# Altium project bms_mainboard-1_1.PrjPcb (part 7 of 8)

## Sheet eth_10base-t1s_phy.SchDoc
size B
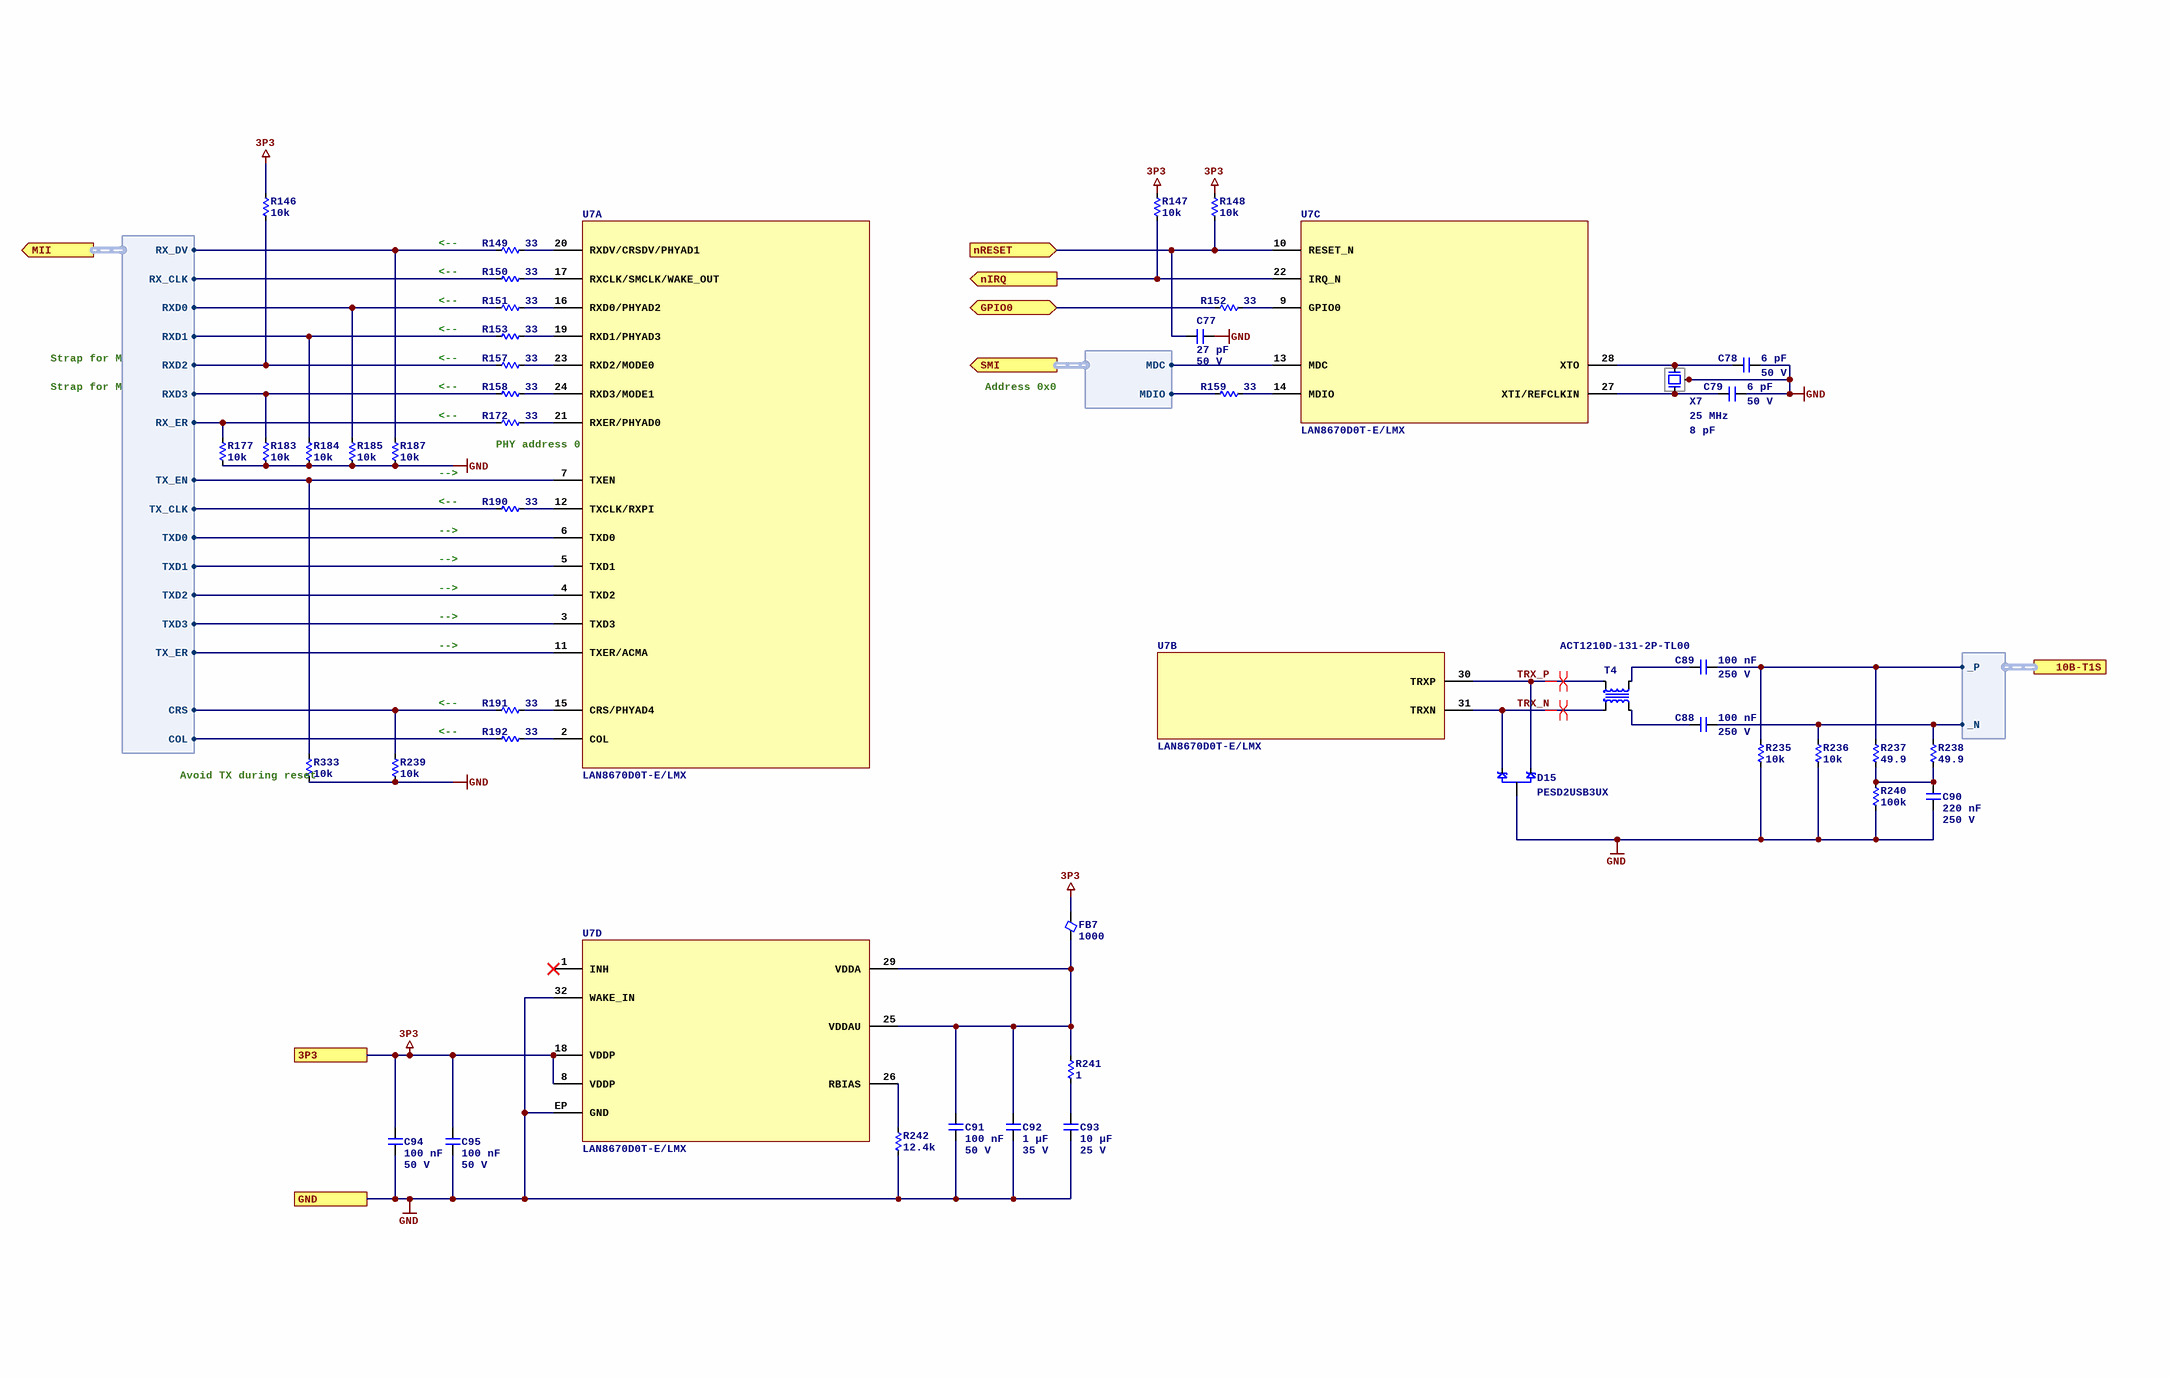
[diagram p39: eth_10base-t1s_phy.SchDoc]

### Parts
C77  Capacitance: 27 pF  Voltage Rating: 50 V  [C0402]  (hidden comment: 0402CG270J500NT)
C78  Capacitance: 6 pF  Voltage Rating: 50 V  [C0402]  (hidden comment: 0402CG6R0C500NT)
C79  Capacitance: 6 pF  Voltage Rating: 50 V  [C0402]  (hidden comment: 0402CG6R0C500NT)
C88  Capacitance: 100 nF  Voltage Rating: 250 V  [C1206]  (hidden comment: FM31X104K251EEG)
C89  Capacitance: 100 nF  Voltage Rating: 250 V  [C1206]  (hidden comment: FM31X104K251EEG)
C90  Capacitance: 220 nF  Voltage Rating: 250 V  [C1210]  (hidden comment: FM32X224K251EEG)
C91  Capacitance: 100 nF  Voltage Rating: 50 V  [C0402]  (hidden comment: CL05B104KB54PNC)
C92  Capacitance: 1 µF  Voltage Rating: 35 V  [C0603]  (hidden comment: GMK107AB7105KAHT)
C93  Capacitance: 10 µF  Voltage Rating: 25 V  [C0805]  (hidden comment: CL21B106KAYQNNE)
C94  Capacitance: 100 nF  Voltage Rating: 50 V  [C0402]  (hidden comment: CL05B104KB54PNC)
C95  Capacitance: 100 nF  Voltage Rating: 50 V  [C0402]  (hidden comment: CL05B104KB54PNC)
D15  PESD2USB3UX  [3SOT23]
FB7  Current Rating (mA): 1000  [FB0805]  (hidden comment: HCB2012KF-102T10)
R146  value 10k  [R0402]  (hidden comment: 0402WGF1002TCE)
R147  value 10k  [R0402]  (hidden comment: 0402WGF1002TCE)
R148  value 10k  [R0402]  (hidden comment: 0402WGF1002TCE)
R149  value 33  [R0402]  (hidden comment: 0402WGF330JTCE)
R150  value 33  [R0402]  (hidden comment: 0402WGF330JTCE)
R151  value 33  [R0402]  (hidden comment: 0402WGF330JTCE)
R152  value 33  [R0402]  (hidden comment: 0402WGF330JTCE)
R153  value 33  [R0402]  (hidden comment: 0402WGF330JTCE)
R157  value 33  [R0402]  (hidden comment: 0402WGF330JTCE)
R158  value 33  [R0402]  (hidden comment: 0402WGF330JTCE)
R159  value 33  [R0402]  (hidden comment: 0402WGF330JTCE)
R172  value 33  [R0402]  (hidden comment: 0402WGF330JTCE)
R177  value 10k  [R0402]  (hidden comment: 0402WGF1002TCE)
R183  value 10k  [R0402]  (hidden comment: 0402WGF1002TCE)
R184  value 10k  [R0402]  (hidden comment: 0402WGF1002TCE)
R185  value 10k  [R0402]  (hidden comment: 0402WGF1002TCE)
R187  value 10k  [R0402]  (hidden comment: 0402WGF1002TCE)
R190  value 33  [R0402]  (hidden comment: 0402WGF330JTCE)
R191  value 33  [R0402]  (hidden comment: 0402WGF330JTCE)
R192  value 33  [R0402]  (hidden comment: 0402WGF330JTCE)
R235  value 10k  [R1206]  (hidden comment: 1206W4F1002T5E)
R236  value 10k  [R1206]  (hidden comment: 1206W4F1002T5E)
R237  value 49.9  [R1206]  (hidden comment: FRC1206F49R9TS)
R238  value 49.9  [R1206]  (hidden comment: FRC1206F49R9TS)
R239  value 10k  [R0402]  (hidden comment: 0402WGF1002TCE)
R240  value 100k  [R1206]  (hidden comment: 1206W4F1003T5E)
R241  value 1  [R0402]  (hidden comment: CRCW04021R00FKED)
R242  value 12.4k  [R0402]  (hidden comment: 0402WGD1242TCE)
R333  value 10k  [R0402]  (hidden comment: 0402WGF1002TCE)
T4  ACT1210D-131-2P-TL00  [CHOKE_ACT1210D-131-2P-TL00]
U7  LAN8670D0T-E/LMX  [QFN50P500X500X90-32N]  (parts A,B,C,D of 4)
X7  Frequency: 25 MHz  Capacitance: 8 pF  [4_SMD_2.0X1.6MM]  (hidden comment: ABM11W-25.0000MHZ-8-D1X-T3)

### Ports
3P3, 10B-T1S (harness DIFF), GND, GPIO0 (bidir), MII (out, harness MII), nIRQ (out), nRESET (in), SMI (out, harness SMI)

### Harnesses
MII: RXD0, RXD1, TX_EN, TXD0, TXD1, RXD2, RXD3, TXD2, TXD3, TX_ER, TX_CLK, CRS, COL, RX_ER, RX_DV, RX_CLK
SMI: MDC, MDIO
DIFF: _N, _P

### Nets
3P3: C94.1 C95.1 FB7.2 R146.1 R147.1 R148.1 U7.8(VDDP) U7.18(VDDP) ; port 3P3
GND: C77.2 C78.2 C79.2 C90.2 C91.2 C92.2 C93.2 C94.2 C95.2 D15.3 R177.2 R183.2 R184.2 R185.2 R187.2 R235.2 R236.2 R239.2 R240.2 R242.2 R333.2 U7.32(WAKE_IN) U7.EP(GND) X7.2 X7.4 ; port GND
10B-T1S_MDI._N: C88.2 R236.1 R238.1 ; port 10B-T1S._N
10B-T1S_MDI._P: C89.2 R235.1 R237.1 ; port 10B-T1S._P
MII_P7.COL: R192.2 ; port MII.COL
MII_P7.CRS: R191.2 R239.1 ; port MII.CRS
MII_P7.RX_CLK: R150.2 ; port MII.RX_CLK
MII_P7.RX_DV: R149.2 R187.1 ; port MII.RX_DV
MII_P7.RX_ER: R172.2 R177.1 ; port MII.RX_ER
MII_P7.RXD0: R151.2 R185.1 ; port MII.RXD0
MII_P7.RXD1: R153.2 R184.1 ; port MII.RXD1
MII_P7.RXD2: R146.2 R157.2 ; port MII.RXD2
MII_P7.RXD3: R158.2 R183.1 ; port MII.RXD3
MII_P7.TX_CLK: R190.2 ; port MII.TX_CLK
MII_P7.TX_EN: R333.1 U7.7(TXEN) ; port MII.TX_EN
MII_P7.TX_ER: U7.11(TXER/ACMA) ; port MII.TX_ER
MII_P7.TXD0: U7.6(TXD0) ; port MII.TXD0
MII_P7.TXD1: U7.5(TXD1) ; port MII.TXD1
MII_P7.TXD2: U7.4(TXD2) ; port MII.TXD2
MII_P7.TXD3: U7.3(TXD3) ; port MII.TXD3
PHY_GPIO0: R152.2 ; port GPIO0
PHY_nIRQ: R147.2 U7.22(IRQ_N) ; port nIRQ
PHY_nRESET: C77.1 R148.2 U7.10(RESET_N) ; port nRESET
SMI.MDC: U7.13(MDC) ; port SMI.MDC
SMI.MDIO: R159.2 ; port SMI.MDIO
TRX_N: D15.1 T4.1 U7.31(TRXN)
TRX_P: D15.2 T4.2 U7.30(TRXP)
NetC78_1: C78.1 U7.28(XTO) X7.3
NetC79_1: C79.1 U7.27(XTI/REFCLKIN) X7.1
NetC88_1: C88.1 T4.4
NetC89_1: C89.1 T4.3
NetC90_1: C90.1 R237.2 R238.2 R240.1
NetC91_1: C91.1 C92.1 FB7.1 R241.2 U7.25(VDDAU) U7.29(VDDA)
NetC93_1: C93.1 R241.1
NetR149_1: R149.1 U7.20(RXDV/CRSDV/PHYAD1)
NetR150_1: R150.1 U7.17(RXCLK/SMCLK/WAKE_OUT)
NetR151_1: R151.1 U7.16(RXD0/PHYAD2)
NetR152_1: R152.1 U7.9(GPIO0)
NetR153_1: R153.1 U7.19(RXD1/PHYAD3)
NetR157_1: R157.1 U7.23(RXD2/MODE0)
NetR158_1: R158.1 U7.24(RXD3/MODE1)
NetR159_1: R159.1 U7.14(MDIO)
NetR172_1: R172.1 U7.21(RXER/PHYAD0)
NetR190_1: R190.1 U7.12(TXCLK/RXPI)
NetR191_1: R191.1 U7.15(CRS/PHYAD4)
NetR192_1: R192.1 U7.2(COL)
NetR242_1: R242.1 U7.26(RBIAS)

Not connected (* = marked no-connect by the designer): U7 1(INH)*

### Layout directives
differential pair; differential pair class DE_100: TRX_N, TRX_P

### Notes on the sheet
- <--
- Strap for MII
- Address 0x0
- (near R187) <--
- PHY address 0
- -->
- (near R187) -->
- (near R239) <--
- (near R333) Avoid TX during reset

### Library data of the parts
C77 = 0402CG270J500NT: Manufacturer: FH(Guangdong Fenghua Advanced Tech); Dielectric: C0G; ComponentLink1URL: https://wmsc.lcsc.com/wmsc/upload/file/pdf/v2/lcsc/2304140030_FH--Guangdong-Fenghua-Advanced-Tech-0402CG270J500NT_C1557.pdf; ComponentLink1Description: Datasheet; Manufacturer Part Number: 0402CG270J500NT; Package: 0402; Supplier 2: LCSC; Supplier Part Number 2: C1557
C78 C79 = 0402CG6R0C500NT: Manufacturer: FH(Guangdong Fenghua Advanced Tech); Dielectric: C0G; ComponentLink1URL: https://wmsc.lcsc.com/wmsc/upload/file/pdf/v2/lcsc/2304140030_FH--Guangdong-Fenghua-Advanced-Tech-0402CG6R0C500NT_C1575.pdf; ComponentLink1Description: Datasheet; Manufacturer Part Number: 0402CG6R0C500NT; Package: 0402; Supplier 2: LCSC; Supplier Part Number 2: C1575
C88 C89 = FM31X104K251EEG: Manufacturer: PSA(Prosperity Dielectrics); Dielectric: X7R; ComponentLink1URL: https://wmsc.lcsc.com/wmsc/upload/file/pdf/v2/lcsc/2409271633_PSA-Prosperity-Dielectrics-FM31X104K251EEG_C365814.pdf; ComponentLink1Description: Datasheet; Manufacturer Part Number: FM31X104K251EEG; Package: 1206; Supplier 2: LCSC; Supplier Part Number 2: C365814
C90 = FM32X224K251EEG: Manufacturer: PSA(Prosperity Dielectrics); Dielectric: X7R; ComponentLink1URL: https://wmsc.lcsc.com/wmsc/upload/file/pdf/v2/lcsc/2304140030_PSA-Prosperity-Dielectrics-FM32X224K251EEG_C146177.pdf; ComponentLink1Description: Datasheet; Manufacturer Part Number: FM32X224K251EEG; Package: 1210; Supplier 2: LCSC; Supplier Part Number 2: C146177
C91 C94 C95 = CL05B104KB54PNC: Manufacturer: Samsung Electro-Mechanics; Dielectric: X7R; ComponentLink1URL: https://wmsc.lcsc.com/wmsc/upload/file/pdf/v2/lcsc/2304140030_Samsung-Electro-Mechanics-CL05B104KB54PNC_C307331.pdf; ComponentLink1Description: Datasheet; Manufacturer Part Number: CL05B104KB54PNC; Package: 0402; Supplier 2: LCSC; Supplier Part Number 2: C307331
C92 = GMK107AB7105KAHT: Manufacturer: Taiyo Yuden; Dielectric: X7R; ComponentLink1URL: https://datasheet.lcsc.com/lcsc/2304140030_Taiyo-Yuden-GMK107AB7105KAHT_C841050.pdf; ComponentLink1Description: Datasheet; Manufacturer Part Number: GMK107AB7105KAHT; Package: 0603; Supplier 2: LCSC; Supplier Part Number 2: C841050
C93 = CL21B106KAYQNNE: Manufacturer: Samsung Electro-Mechanics; Dielectric: X7R; ComponentLink1URL: https://datasheet.lcsc.com/lcsc/2206222030_Samsung-Electro-Mechanics-CL21B106KAYQNNE_C3039694.pdf; ComponentLink1Description: Datasheet; Manufacturer Part Number: CL21B106KAYQNNE; Package: 0805; Supplier 2: LCSC; Supplier Part Number 2: C3039694
D15 = PESD2USB3UX: DIODE ESD USB SOT-23; Manufacturer: Nexperia USA Inc.; Polarity: Unidirectional; Capacitance (pF): 0.7; Standoff (V): 3.3; Min Breakdown Voltage: 4.2 V; Supplier 1: DigiKey; Supplier Part Number 1: 1727-PESD2USB3UX-CT-ND; Manufacturer Part Number: PESD2USB3UX; Supplier 2: LCSC; Supplier Part Number 2: C3708426; ComponentLink1Description: Datasheet; ComponentLink1URL: https://assets.nexperia.com/documents/data-sheet/PESD2USB3UX-T.pdf; Supplier 3: Mouser; Supplier Part Number 3: 771-PESD2USB3UX-TR
FB7 = HCB2012KF-102T10: Manufacturer: TAI-TECH; DCR (mOhms): 200; ComponentLink1URL: https://wmsc.lcsc.com/wmsc/upload/file/pdf/v2/lcsc/2009171138_TAI-TECH-HCB2012KF-102T10_C356985.pdf; ComponentLink1Description: Datasheet; Manufacturer Part Number: HCB2012KF-102T10; Supplier 2: LCSC; Supplier Part Number 2: C356985; Package: 0805; Z @ 100 MHz: 1000
R146-R148 R177 R183-R185 R187 R239 R333 = 0402WGF1002TCE: Manufacturer: UNI-ROYAL(Uniroyal Elec); Tolerance: 1%; Temperature Coefficient: ±100ppm/?; Power Rating (mW): 62.5; ComponentLink1Description: Datasheet; ComponentLink1URL: https://wmsc.lcsc.com/wmsc/upload/file/pdf/v2/lcsc/2206010100_UNI-ROYAL-Uniroyal-Elec-0402WGF1002TCE_C25744.pdf; Manufacturer Part Number: 0402WGF1002TCE; Package: 0402; Supplier 2: LCSC; Supplier Part Number 2: C25744
R149-R153 R157-R159 R172 R190-R192 = 0402WGF330JTCE: Manufacturer: UNI-ROYAL(Uniroyal Elec); Tolerance: 1%; Temperature Coefficient: ±100ppm/?; Power Rating (mW): 62.5; ComponentLink1Description: Datasheet; ComponentLink1URL: https://wmsc.lcsc.com/wmsc/upload/file/pdf/v2/lcsc/2205311900_UNI-ROYAL-Uniroyal-Elec-0402WGF330JTCE_C25105.pdf; Manufacturer Part Number: 0402WGF330JTCE; Package: 0402; Supplier 2: LCSC; Supplier Part Number 2: C25105
R235 R236 = 1206W4F1002T5E: Manufacturer: UNI-ROYAL(Uniroyal Elec); Tolerance: 1%; Temperature Coefficient: ±100ppm/?; Power Rating (mW): 250; ComponentLink1Description: Datasheet; ComponentLink1URL: https://wmsc.lcsc.com/wmsc/upload/file/pdf/v2/lcsc/2206010145_UNI-ROYAL-Uniroyal-Elec-1206W4F1002T5E_C17902.pdf; Manufacturer Part Number: 1206W4F1002T5E; Package: 1206; Supplier 2: LCSC; Supplier Part Number 2: C17902
R237 R238 = FRC1206F49R9TS: Manufacturer: FOJAN; Tolerance: 1%; Temperature Coefficient: ±100ppm/?; Power Rating (mW): 250; ComponentLink1Description: Datasheet; ComponentLink1URL: https://datasheet.lcsc.com/lcsc/2308241947_FOJAN-FRC1206F49R9TS_C2907389.pdf; Manufacturer Part Number: FRC1206F49R9TS; Package: 1206; Supplier 2: LCSC; Supplier Part Number 2: C2907389
R240 = 1206W4F1003T5E: Manufacturer: UNI-ROYAL(Uniroyal Elec); Tolerance: 1%; Temperature Coefficient: ±100ppm/?; Power Rating (mW): 250; ComponentLink1Description: Datasheet; ComponentLink1URL: https://wmsc.lcsc.com/wmsc/upload/file/pdf/v2/lcsc/2206010145_UNI-ROYAL-Uniroyal-Elec-1206W4F1003T5E_C17900.pdf; Manufacturer Part Number: 1206W4F1003T5E; Package: 1206; Supplier 2: LCSC; Supplier Part Number 2: C17900
R241 = CRCW04021R00FKED: Manufacturer: Vishay Intertech; Tolerance: 1%; Temperature Coefficient: ±100ppm/?; Power Rating (mW): 63; ComponentLink1Description: Datasheet; ComponentLink1URL: https://wmsc.lcsc.com/wmsc/upload/file/pdf/v2/lcsc/2211030200_Vishay-Intertech-CRCW04021R00FKED_C482087.pdf; Manufacturer Part Number: CRCW04021R00FKED; Package: 0402; Supplier 2: LCSC; Supplier Part Number 2: C482087
R242 = 0402WGD1242TCE: Manufacturer: UNI-ROYAL(Uniroyal Elec); Tolerance: 0.5%; Temperature Coefficient: ±100ppm/?; Power Rating (mW): 62.5; ComponentLink1Description: Datasheet; ComponentLink1URL: https://wmsc.lcsc.com/wmsc/upload/file/pdf/v2/lcsc/2411221127_UNI-ROYAL-Uniroyal-Elec-0402WGD1242TCE_C407750.pdf; Manufacturer Part Number: 0402WGD1242TCE; Package: 0402; Supplier 2: LCSC; Supplier Part Number 2: C407750
T4 = ACT1210D-131-2P-TL00: 130 µH @ 100 kHz 2 Line Common Mode Choke Surface Mount 6.7 kOhms @ 10 MHz 115mA DCR 3.5Ohm; Manufacturer: TDK Corporation; Supplier 1: DigiKey; ComponentLink1URL: https://product.tdk.com/system/files/dam/doc/product/emc/emc/cmf_cmc/catalog/cmf_automotive_signal_act1210d_en.pdf; ComponentLink1Description: Datasheet; Supplier Part Number 1: 445-ACT1210D-131-2P-TL00CT-ND; Manufacturer Part Number: ACT1210D-131-2P-TL00; Supplier 2: LCSC; Supplier Part Number 2: C5547342; Supplier 3: Mouser; Supplier Part Number 3: 810-ACT1210D1312PTL0
U7 = LAN8670D0T-E/LMX: 10BASE-T1S PHY WITH MII/RMII "1/1 Transceiver Full, Half Ethernet 32-VQFN (5x5)"; Manufacturer: Microchip; Supplier 1: DigiKey; Supplier Part Number 1: 150-LAN8670D0T-E/LMXTR-ND; Manufacturer Part Number: LAN8670D0T-E/LMX; ComponentLink1Description: Datasheet; ComponentLink1URL: https://ww1.microchip.com/downloads/aemDocuments/documents/AIS/ProductDocuments/DataSheets/LAN8670-1-2-Data-Sheet-60001573.pdf; Supplier 3: Microchip Direct; Supplier Part Number 3: LAN8670D0T-E/LMX
X7 = ABM11W-25.0000MHZ-8-D1X-T3: 25 MHz ±10ppm Crystal 8pF 50 Ohms 4-SMD, No Lead; Manufacturer: Abracon LLC; Supplier 1: DigiKey; Supplier Part Number 1: 535-13853-1-ND; Manufacturer Part Number: ABM11W-25.0000MHZ-8-D1X-T3; Supplier 2: LCSC; Supplier Part Number 2: C1985767; ComponentLink1Description: Datasheet; ComponentLink1URL: https://abracon.com/Resonators/ABM11W.pdf; Supplier 3: Mouser; Supplier Part Number 3: 815-11W25-8D1XT

## Sheet isolator_si8662.SchDoc
size A
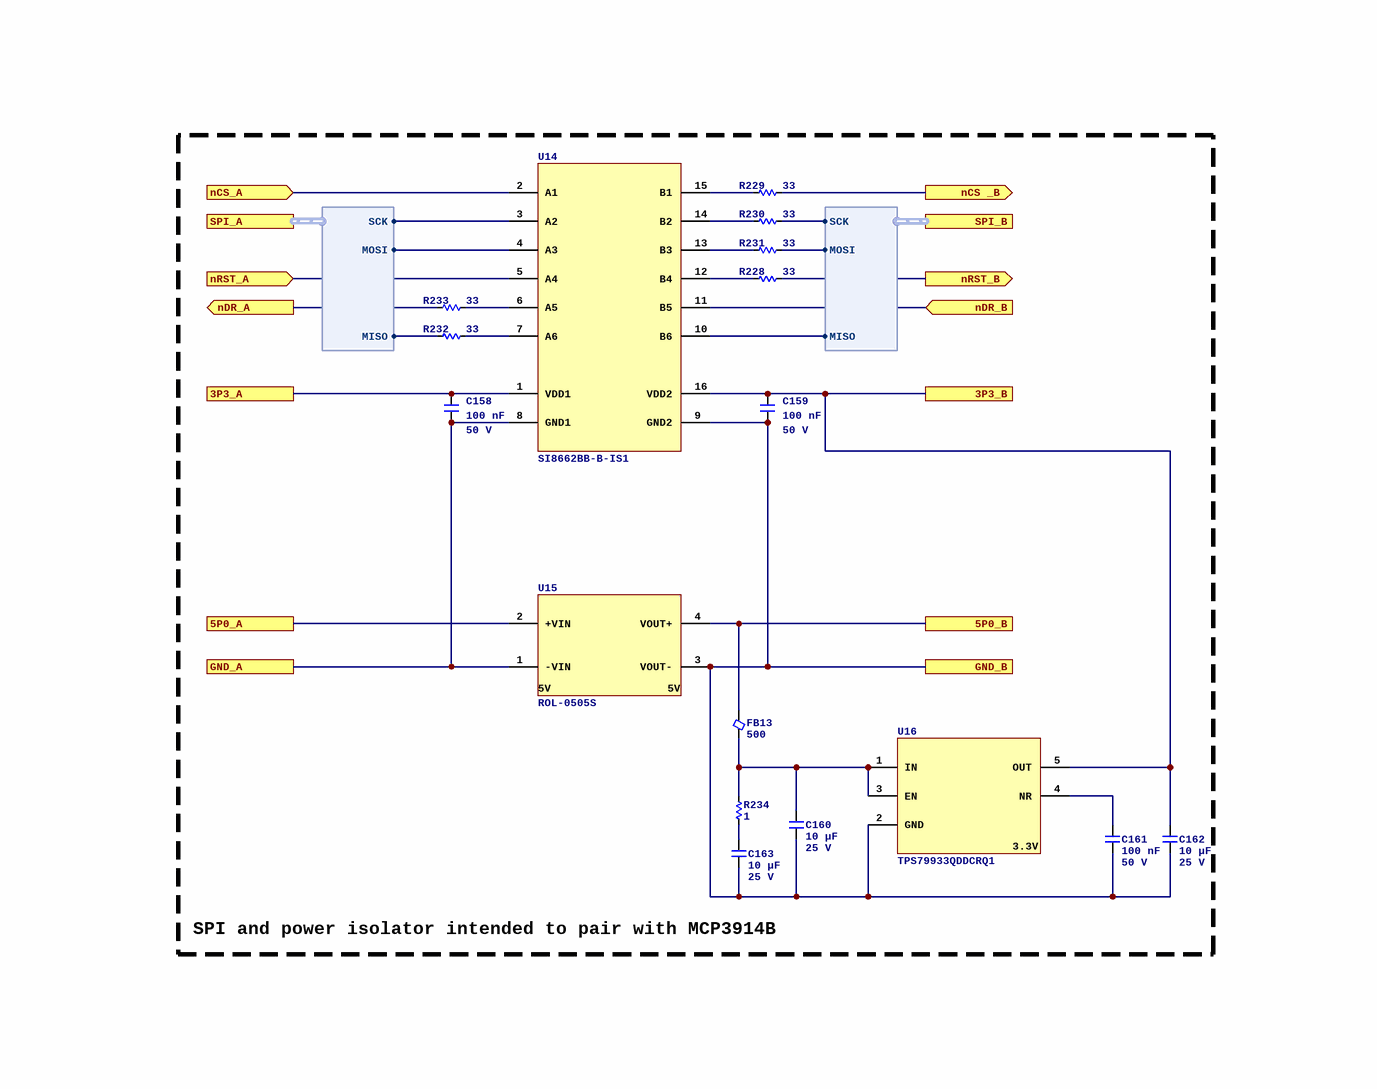
[diagram p40: isolator_si8662.SchDoc]

### Parts
C158  Capacitance: 100 nF  Voltage Rating: 50 V  [C0402]  (hidden comment: CL05B104KB54PNC)
C159  Capacitance: 100 nF  Voltage Rating: 50 V  [C0402]  (hidden comment: CL05B104KB54PNC)
C160  Capacitance: 10 µF  Voltage Rating: 25 V  [C0603]  (hidden comment: CL10A106MA8NRNC)
C161  Capacitance: 100 nF  Voltage Rating: 50 V  [C0402]  (hidden comment: CL05B104KB54PNC)
C162  Capacitance: 10 µF  Voltage Rating: 25 V  [C0805]  (hidden comment: CL21B106KAYQNNE)
C163  Capacitance: 10 µF  Voltage Rating: 25 V  [C0805]  (hidden comment: CL21B106KAYQNNE)
FB13  Current Rating (mA): 500  [FB0402]  (hidden comment: BLM15AX601SN1D)
R228  value 33  [R0402]  (hidden comment: 0402WGF330JTCE)
R229  value 33  [R0402]  (hidden comment: 0402WGF330JTCE)
R230  value 33  [R0402]  (hidden comment: 0402WGF330JTCE)
R231  value 33  [R0402]  (hidden comment: 0402WGF330JTCE)
R232  value 33  [R0402]  (hidden comment: 0402WGF330JTCE)
R233  value 33  [R0402]  (hidden comment: 0402WGF330JTCE)
R234  value 1  [R0402]  (hidden comment: CRCW04021R00FKED)
U14  SI8662BB-B-IS1  [16SOIC150]
U15  ROL-0505S  [4SIP]
U16  TPS79933QDDCRQ1  [5SOT23]

### Blocks framed on the sheet
SPI and power isolator intended to pair with MCP3914B: C158-C163 FB13 R228-R234 U14-U16

### Ports
3P3_A, 3P3_B, 5P0_A, 5P0_B, GND_A, GND_B, nCS _B (out), nCS_A (in), nDR_A (out), nDR_B (in), nRST_A (in), nRST_B (out), SPI_A (harness SPI), SPI_B (harness SPI)

### Harnesses
SPI: MISO, MOSI, SCK

### Nets
3P3: C158.1 U14.1(VDD1) ; port 3P3_A
3P3_B: C159.1 C162.1 U14.16(VDD2) U16.5(OUT) ; port 3P3_B
5P0: U15.2(+VIN) ; port 5P0_A
5P0_B: FB13.2 U15.4(VOUT+) ; port 5P0_B
GND: C158.2 U14.8(GND1) U15.1(-VIN) ; port GND_A
HV_N: C159.2 C160.2 C161.2 C162.2 C163.2 U14.9(GND2) U15.3(VOUT-) U16.2(GND) ; port GND_B
MCP3914B_nDR: R233.2 ; port nDR_A
MCP3914B_nDR_ISO: U14.11(B5) ; port nDR_B
MCP3914B_nRST: U14.5(A4) ; port nRST_A
MCP3914B_nRST_ISO: R228.1 ; port nRST_B
SPI4.MISO: R232.2 ; port SPI_A.MISO
SPI4.MOSI: U14.4(A3) ; port SPI_A.MOSI
SPI4.SCK: U14.3(A2) ; port SPI_A.SCK
SPI4_ISO.MISO: U14.10(B6) ; port SPI_B.MISO
SPI4_ISO.MOSI: R231.1 ; port SPI_B.MOSI
SPI4_ISO.SCK: R230.1 ; port SPI_B.SCK
SPI4_nSS: U14.2(A1) ; port nCS_A
SPI4_nSS_ISO: R229.1 ; port nCS _B
NetC160_1: C160.1 FB13.1 R234.2 U16.1(IN) U16.3(EN)
NetC161_1: C161.1 U16.4(NR)
NetC163_1: C163.1 R234.1
NetR228_2: R228.2 U14.12(B4)
NetR229_2: R229.2 U14.15(B1)
NetR230_2: R230.2 U14.14(B2)
NetR231_2: R231.2 U14.13(B3)
NetR232_1: R232.1 U14.7(A6)
NetR233_1: R233.1 U14.6(A5)

### Notes on the sheet
- (in symbol ROL-0505S) 5V
- (in symbol TPS79933QDDCRQ1) 3.3V

### Library data of the parts
C158 C159 C161 = CL05B104KB54PNC: as C91 on sheet eth_10base-t1s_phy; ComponentLink1URL: https://wmsc.lcsc.com/wmsc/upload/file/pdf/v2/lcsc/2304140030_Samsung-Electro-Mechanics-CL05B104KB54PNC_C307331.pdf; ComponentLink1Description: Datasheet; Manufacturer Part Number: CL05B104KB54PNC; Package: 0402; Supplier 2: LCSC; Supplier Part Number 2: C307331
C160 = CL10A106MA8NRNC: Manufacturer: Samsung Electro-Mechanics; Dielectric: X5R; ComponentLink1URL: https://wmsc.lcsc.com/wmsc/upload/file/pdf/v2/lcsc/2304140030_Samsung-Electro-Mechanics-CL10A106MA8NRNC_C96446.pdf; ComponentLink1Description: Datasheet; Manufacturer Part Number: CL10A106MA8NRNC; Package: 0603; Supplier 2: LCSC; Supplier Part Number 2: C96446
C162 C163 = CL21B106KAYQNNE: as C93 on sheet eth_10base-t1s_phy; ComponentLink1URL: https://datasheet.lcsc.com/lcsc/2206222030_Samsung-Electro-Mechanics-CL21B106KAYQNNE_C3039694.pdf; ComponentLink1Description: Datasheet; Manufacturer Part Number: CL21B106KAYQNNE; Package: 0805; Supplier 2: LCSC; Supplier Part Number 2: C3039694
FB13 = BLM15AX601SN1D: Manufacturer: Murata Electronics; Z @ 100 MHz: 600; DCR (mOhms): 340; ComponentLink1URL: https://wmsc.lcsc.com/wmsc/upload/file/pdf/v2/lcsc/2304140030_Murata-Electronics-BLM15AX601SN1D_C76886.pdf; ComponentLink1Description: Datasheet; Manufacturer Part Number: BLM15AX601SN1D; Supplier 2: LCSC; Supplier Part Number 2: C76886; Package: 0402
R228-R233 = 0402WGF330JTCE: as R149-R153 on sheet eth_10base-t1s_phy; ComponentLink1Description: Datasheet; ComponentLink1URL: https://wmsc.lcsc.com/wmsc/upload/file/pdf/v2/lcsc/2205311900_UNI-ROYAL-Uniroyal-Elec-0402WGF330JTCE_C25105.pdf; Manufacturer Part Number: 0402WGF330JTCE; Package: 0402; Supplier 2: LCSC; Supplier Part Number 2: C25105
R234 = CRCW04021R00FKED: as R241 on sheet eth_10base-t1s_phy; ComponentLink1Description: Datasheet; ComponentLink1URL: https://wmsc.lcsc.com/wmsc/upload/file/pdf/v2/lcsc/2211030200_Vishay-Intertech-CRCW04021R00FKED_C482087.pdf; Manufacturer Part Number: CRCW04021R00FKED; Package: 0402; Supplier 2: LCSC; Supplier Part Number 2: C482087
U14 = SI8662BB-B-IS1: 6-ch 2.5kV Isolator, 150M, 4/2, NB SOIC16, lead free; Manufacturer: Skyworks Solutions; Supplier 1: DigiKey; Supplier Part Number 1: SI8662BB-B-IS1-ND; Manufacturer Part Number: SI8662BB-B-IS1; Supplier 2: LCSC; Supplier Part Number 2: C430287; ComponentLink1Description: Datasheet; ComponentLink1URL: https://www.skyworksinc.com/-/media/Skyworks/SL/documents/public/data-sheets/Si866x.pdf; Supplier 3: Mouser; Supplier Part Number 3: 634-SI8662BB-B-IS1
U15 = ROL-0505S: 5V to 5V isolated power supply module; Manufacturer: Recom; Supplier 1: DigiKey; Supplier Part Number 1: 945-1949-5-ND; Manufacturer Part Number: ROL-0505S; ComponentLink1Description: Datasheet; ComponentLink1URL: https://recom-power.com/pdf/Econoline/ROL.pdf; Supplier 2: LCSC; Supplier Part Number 2: C22372006
U16 = TPS79933QDDCRQ1: Fixed Positive LDO Regulator, 3.3V, 0.16V Dropout, BICMOS, PDSO5; Manufacturer: Texas Instruments; Supplier 1: DigiKey; Supplier Part Number 1: 296-24852-1-ND; Manufacturer Part Number: TPS79933QDDCRQ1; ComponentLink1Description: Datasheet; ComponentLink1URL: https://www.ti.com/lit/ds/symlink/tps799-q1.pdf; Supplier 2: LCSC; Supplier Part Number 2: C2865613; Supplier 3: Mouser; Supplier Part Number 3: 595-TPS79933QDDCRQ1

## Sheet pmic_tps79933.SchDoc
size A
Used 2 times, as channels pmic_tps79933_usb, pmic_tps79933_gnss. Parts and nets are listed once, with the designators drawn on the sheet.
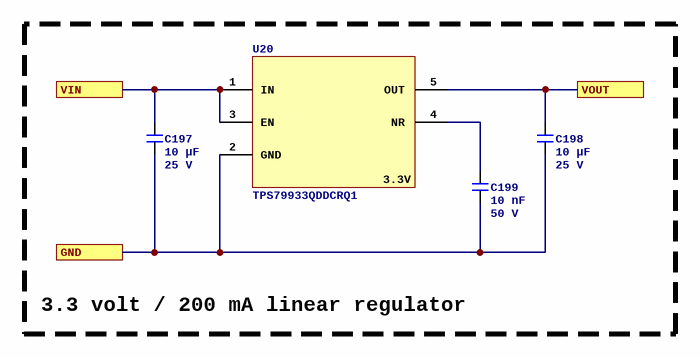
[diagram p41: pmic_tps79933.SchDoc]

### Parts
C197  Capacitance: 10 µF  Voltage Rating: 25 V  [C0805]  (hidden comment: CL21B106KAYQNNE)
C198  Capacitance: 10 µF  Voltage Rating: 25 V  [C0805]  (hidden comment: CL21B106KAYQNNE)
C199  Capacitance: 10 nF  Voltage Rating: 50 V  [C0402]  (hidden comment: CL05B103KB5NNNC)
U20  TPS79933QDDCRQ1  [5SOT23]

### Blocks framed on the sheet
3.3 volt / 200 mA linear regulator: C197-C199 U20

### Ports
GND, VIN, VOUT

### Nets
GND: C197.2 C198.2 C199.2 U20.2(GND) ; port GND
VIN: C197.1 U20.1(IN) U20.3(EN) ; port VIN
VOUT: C198.1 U20.5(OUT) ; port VOUT
NetC199_1: C199.1 U20.4(NR)

### Channels
pmic_tps79933_usb: designators end in A; ports GND=GND VIN=VBUS VOUT=3P3_USB
pmic_tps79933_gnss: designators end in B; ports GND=GND VIN=5P0 VOUT=3P3_GNSS

### Notes on the sheet
- (in symbol TPS79933QDDCRQ1) 3.3V

### Library data of the parts
C197 C198 = CL21B106KAYQNNE: as C93 on sheet eth_10base-t1s_phy; ComponentLink1URL: https://datasheet.lcsc.com/lcsc/2206222030_Samsung-Electro-Mechanics-CL21B106KAYQNNE_C3039694.pdf; ComponentLink1Description: Datasheet; Manufacturer Part Number: CL21B106KAYQNNE; Package: 0805; Supplier 2: LCSC; Supplier Part Number 2: C3039694
C199 = CL05B103KB5NNNC: Manufacturer: Samsung Electro-Mechanics; Dielectric: X7R; ComponentLink1URL: https://wmsc.lcsc.com/wmsc/upload/file/pdf/v2/lcsc/2304140030_Samsung-Electro-Mechanics-CL05B103KB5NNNC_C15195.pdf; ComponentLink1Description: Datasheet; Manufacturer Part Number: CL05B103KB5NNNC; Package: 0402; Supplier 2: LCSC; Supplier Part Number 2: C15195
U20 = TPS79933QDDCRQ1: as U16 on sheet isolator_si8662; Supplier 1: DigiKey; Supplier Part Number 1: 296-24852-1-ND; Manufacturer Part Number: TPS79933QDDCRQ1; ComponentLink1Description: Datasheet; ComponentLink1URL: https://www.ti.com/lit/ds/symlink/tps799-q1.pdf; Supplier 2: LCSC; Supplier Part Number 2: C2865613; Supplier 3: Mouser; Supplier Part Number 3: 595-TPS79933QDDCRQ1

## Sheet imu_ism330.SchDoc
size A
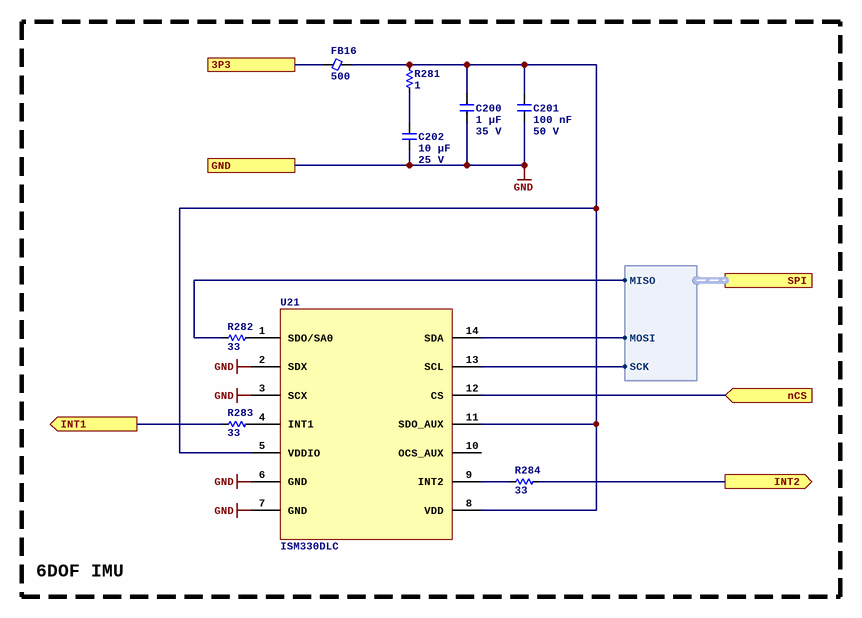
[diagram p42: imu_ism330.SchDoc]

### Parts
C200  Capacitance: 1 µF  Voltage Rating: 35 V  [C0603]  (hidden comment: GMK107AB7105KAHT)
C201  Capacitance: 100 nF  Voltage Rating: 50 V  [C0402]  (hidden comment: CL05B104KB54PNC)
C202  Capacitance: 10 µF  Voltage Rating: 25 V  [C0805]  (hidden comment: CL21B106KAYQNNE)
FB16  Current Rating (mA): 500  [FB0402]  (hidden comment: BLM15AX601SN1D)
R281  value 1  [R0402]  (hidden comment: CRCW04021R00FKED)
R282  value 33  [R0402]  (hidden comment: 0402WGF330JTCE)
R283  value 33  [R0402]  (hidden comment: 0402WGF330JTCE)
R284  value 33  [R0402]  (hidden comment: 0402WGF330JTCE)
U21  ISM330DLC  [ST_LGA-14L]

### Blocks framed on the sheet
6DOF IMU: C200-C202 FB16 R281-R284 U21

### Ports
3P3, GND, INT1 (out), INT2 (out), nCS (in), SPI (harness SPI)

### Harnesses
SPI: MISO, MOSI, SCK

### Nets
3P3: FB16.1 ; port 3P3
GND: C200.2 C201.2 C202.2 U21.2(SDX) U21.3(SCX) U21.6(GND) U21.7(GND) ; port GND
IMU_INT1: R283.1 ; port INT1
IMU_INT2: R284.2 ; port INT2
SPI6.MISO: R282.1 ; port SPI.MISO
SPI6.MOSI: U21.14(SDA) ; port SPI.MOSI
SPI6.SCK: U21.13(SCL) ; port SPI.SCK
SPI6_nSS: U21.12(CS) ; port nCS
NetC200_1: C200.1 C201.1 FB16.2 R281.2 U21.5(VDDIO) U21.8(VDD) U21.11(SDO_AUX)
NetC202_1: C202.1 R281.1
NetR282_2: R282.2 U21.1(SDO/SA0)
NetR283_2: R283.2 U21.4(INT1)
NetR284_1: R284.1 U21.9(INT2)

Not connected (* = marked no-connect by the designer): U21 10(OCS_AUX)

### Library data of the parts
C200 = GMK107AB7105KAHT: as C92 on sheet eth_10base-t1s_phy; ComponentLink1URL: https://datasheet.lcsc.com/lcsc/2304140030_Taiyo-Yuden-GMK107AB7105KAHT_C841050.pdf; ComponentLink1Description: Datasheet; Manufacturer Part Number: GMK107AB7105KAHT; Package: 0603; Supplier 2: LCSC; Supplier Part Number 2: C841050
C201 = CL05B104KB54PNC: as C91 on sheet eth_10base-t1s_phy; ComponentLink1URL: https://wmsc.lcsc.com/wmsc/upload/file/pdf/v2/lcsc/2304140030_Samsung-Electro-Mechanics-CL05B104KB54PNC_C307331.pdf; ComponentLink1Description: Datasheet; Manufacturer Part Number: CL05B104KB54PNC; Package: 0402; Supplier 2: LCSC; Supplier Part Number 2: C307331
C202 = CL21B106KAYQNNE: as C93 on sheet eth_10base-t1s_phy; ComponentLink1URL: https://datasheet.lcsc.com/lcsc/2206222030_Samsung-Electro-Mechanics-CL21B106KAYQNNE_C3039694.pdf; ComponentLink1Description: Datasheet; Manufacturer Part Number: CL21B106KAYQNNE; Package: 0805; Supplier 2: LCSC; Supplier Part Number 2: C3039694
FB16 = BLM15AX601SN1D: as FB13 on sheet isolator_si8662; ComponentLink1URL: https://wmsc.lcsc.com/wmsc/upload/file/pdf/v2/lcsc/2304140030_Murata-Electronics-BLM15AX601SN1D_C76886.pdf; ComponentLink1Description: Datasheet; Manufacturer Part Number: BLM15AX601SN1D; Package: 0402; Supplier 2: LCSC; Supplier Part Number 2: C76886
R281 = CRCW04021R00FKED: as R241 on sheet eth_10base-t1s_phy; ComponentLink1Description: Datasheet; ComponentLink1URL: https://wmsc.lcsc.com/wmsc/upload/file/pdf/v2/lcsc/2211030200_Vishay-Intertech-CRCW04021R00FKED_C482087.pdf; Manufacturer Part Number: CRCW04021R00FKED; Package: 0402; Supplier 2: LCSC; Supplier Part Number 2: C482087
R282-R284 = 0402WGF330JTCE: as R149-R153 on sheet eth_10base-t1s_phy; ComponentLink1Description: Datasheet; ComponentLink1URL: https://wmsc.lcsc.com/wmsc/upload/file/pdf/v2/lcsc/2205311900_UNI-ROYAL-Uniroyal-Elec-0402WGF330JTCE_C25105.pdf; Manufacturer Part Number: 0402WGF330JTCE; Package: 0402; Supplier 2: LCSC; Supplier Part Number 2: C25105
U21 = ISM330DLC: ST ACCELEROMETER/GYROSCOPE 3D 14LGA LOW POWER; Manufacturer: ST Microelectronics; Supplier 1: DigiKey; Supplier Part Number 1: 497-17583-6-ND; ComponentLink1Description: Datasheet; ComponentLink1URL: https://www.st.com/resource/en/datasheet/ism330dlc.pdf; Manufacturer Part Number: ISM330DLC; Supplier 2: LCSC; Supplier Part Number 2: C2943126

## Sheet dht_bme280.SchDoc
size A
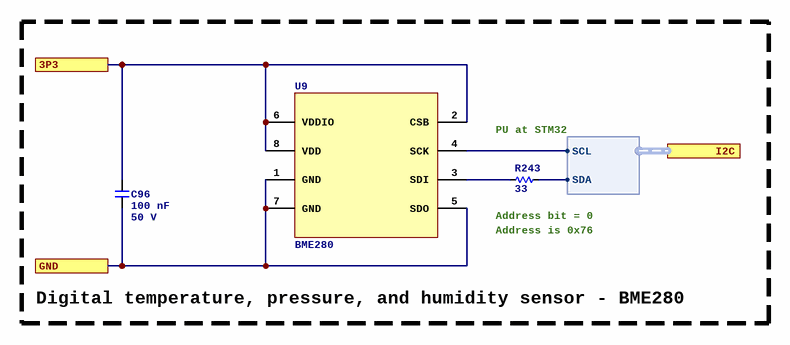
[diagram p43: dht_bme280.SchDoc]

### Parts
C96  Capacitance: 100 nF  Voltage Rating: 50 V  [C0402]  (hidden comment: CL05B104KB54PNC)
R243  value 33  [R0402]  (hidden comment: 0402WGF330JTCE)
U9  BME280  [BOSCH_BME280]

### Blocks framed on the sheet
Digital temperature, pressure, and humidity sensor - BME280: C96 R243 U9

### Ports
3P3, GND, I2C (harness I2C)

### Harnesses
I2C: SCL, SDA

### Nets
3P3: C96.1 U9.2(CSB) U9.6(VDDIO) U9.8(VDD) ; port 3P3
GND: C96.2 U9.1(GND) U9.5(SDO) U9.7(GND) ; port GND
I2C1.SCL: U9.4(SCK) ; port I2C.SCL
I2C1.SDA: R243.1 ; port I2C.SDA
NetR243_2: R243.2 U9.3(SDI)

### Notes on the sheet
- PU at STM32
- Address is 0x76
- (near R243) Address bit = 0

### Library data of the parts
C96 = CL05B104KB54PNC: as C91 on sheet eth_10base-t1s_phy; ComponentLink1URL: https://wmsc.lcsc.com/wmsc/upload/file/pdf/v2/lcsc/2304140030_Samsung-Electro-Mechanics-CL05B104KB54PNC_C307331.pdf; ComponentLink1Description: Datasheet; Manufacturer Part Number: CL05B104KB54PNC; Package: 0402; Supplier 2: LCSC; Supplier Part Number 2: C307331
R243 = 0402WGF330JTCE: as R149-R153 on sheet eth_10base-t1s_phy; ComponentLink1Description: Datasheet; ComponentLink1URL: https://wmsc.lcsc.com/wmsc/upload/file/pdf/v2/lcsc/2205311900_UNI-ROYAL-Uniroyal-Elec-0402WGF330JTCE_C25105.pdf; Manufacturer Part Number: 0402WGF330JTCE; Package: 0402; Supplier 2: LCSC; Supplier Part Number 2: C25105
U9 = BME280: Pressure, Temperature and Humidity Sensor Digital Output 1.8V 8-Pin LGA T/R; Manufacturer: Bosch Tools; Supplier 1: DigiKey; Supplier Part Number 1: 828-1063-1-ND; Manufacturer Part Number: BME280; ComponentLink1Description: Datasheet; ComponentLink1URL: https://www.bosch-sensortec.com/media/boschsensortec/downloads/datasheets/bst-bme280-ds002.pdf; Supplier 2: LCSC; Supplier Part Number 2: C92489; Supplier 3: Mouser; Supplier Part Number 3: 262-BME280

## Sheet gnss_quectel_lc29hea.SchDoc
size A
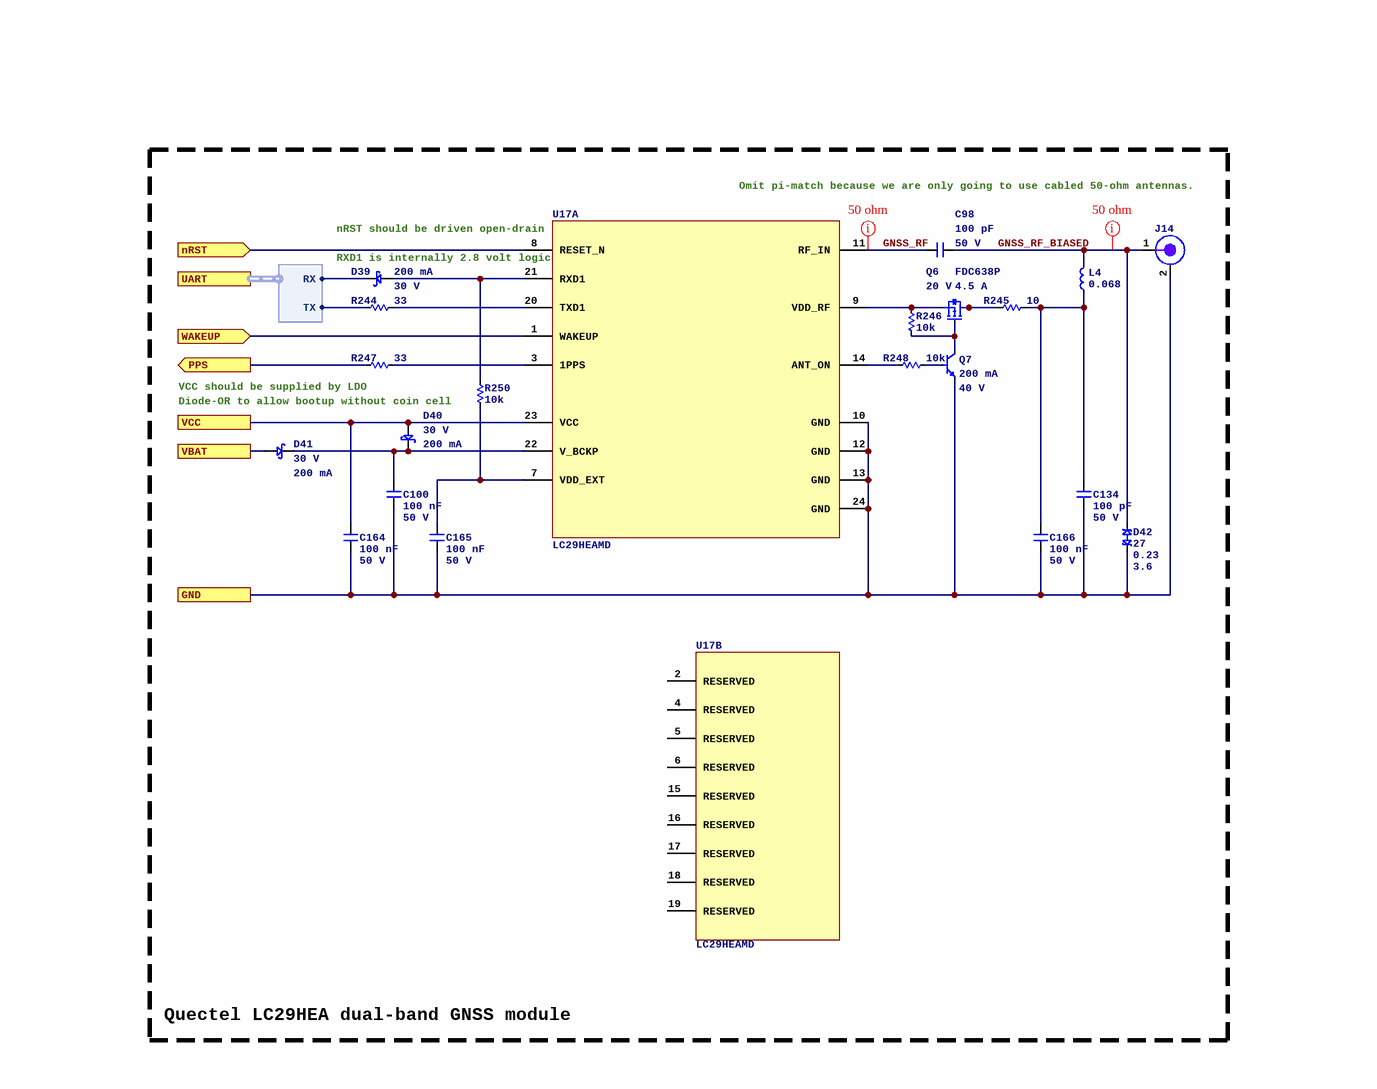
[diagram p44: gnss_quectel_lc29hea.SchDoc]

### Parts
C98  Capacitance: 100 pF  Voltage Rating: 50 V  [C0402]  (hidden comment: 0402CG101J500NT)
C100  Capacitance: 100 nF  Voltage Rating: 50 V  [C0402]  (hidden comment: CL05B104KB54PNC)
C134  Capacitance: 100 pF  Voltage Rating: 50 V  [C0402]  (hidden comment: 0402CG101J500NT)
C164  Capacitance: 100 nF  Voltage Rating: 50 V  [C0402]  (hidden comment: CL05B104KB54PNC)
C165  Capacitance: 100 nF  Voltage Rating: 50 V  [C0402]  (hidden comment: CL05B104KB54PNC)
C166  Capacitance: 100 nF  Voltage Rating: 50 V  [C0402]  (hidden comment: CL05B104KB54PNC)
D39  Current: 200 mA  Vr: 30 V  [SOD523]  (hidden comment: BAT54XV2T1G)
D40  Current: 200 mA  Vr: 30 V  [SOD523]  (hidden comment: BAT54XV2T1G)
D41  Current: 200 mA  Vr: 30 V  [SOD523]  (hidden comment: BAT54XV2T1G)
D42  Power (W): 27  Capacitance (pF): 0.23  Standoff (V): 3.6  [TI_DPY0002A]  (hidden comment: TPD1E01B04DPYR)
J14  RFPC-SMA14-FN-A  [GCT_RFPC-SMA14-FN-A]  (value not drawn)
L4  Inductance (µH): 0.068  [L0603_0.95MM]  (hidden comment: LQW18AN68NJ80D)
Q6  FDC638P  Voltage: 20 V  Current: 4.5 A  [6SOT23]
Q7  Current: 200 mA  Voltage: 40 V  [3SOT523]  (hidden comment: MMBT3904T)
R244  value 33  [R0402]  (hidden comment: 0402WGF330JTCE)
R245  value 10  [R2512]  (hidden comment: RTT2510R0FTE)
R246  value 10k  [R0402]  (hidden comment: 0402WGF1002TCE)
R247  value 33  [R0402]  (hidden comment: 0402WGF330JTCE)
R248  value 10k  [R0402]  (hidden comment: 0402WGF1002TCE)
R250  value 10k  [R0402]  (hidden comment: 0402WGF1002TCE)
U17  LC29HEAMD  [QUECTEL_LC29H]  (parts A,B of 2)

### Ports
GND, nRST (in), PPS (out), UART (harness UART), VBAT, VCC, WAKEUP (in)

### Harnesses
UART: RX, TX

### Nets
GND: C100.2 C134.2 C164.2 C165.2 C166.2 D42.1 J14.2(GND) Q7.2(E) U17.10(GND) U17.12(GND) U17.13(GND) U17.24(GND) ; port GND
VBAT: D41.1 ; port VBAT
3P3_GNSS: C164.1 D40.1 U17.23(VCC) ; port VCC
GNSS_nRST: U17.8(RESET_N) ; port nRST
GNSS_RF: C98.1 U17.11(RF_IN)
GNSS_RF_BIASED: C98.2 D42.2 J14.1(RF) L4.2
GNSS_WAKEUP: U17.1(WAKEUP) ; port WAKEUP
TIMEPULSE: R247.2 ; port PPS
UART8.RX: R244.2 ; port UART.TX
UART8.TX: D39.2 ; port UART.RX
NetC100_1: C100.1 D40.2 D41.2 U17.22(V_BCKP)
NetC134_1: C134.1 C166.1 L4.1 R245.1
NetC165_1: C165.1 R250.2 U17.7(VDD_EXT)
NetD39_1: D39.1 R250.1 U17.21(RXD1)
NetQ6_1: Q6.1 Q6.2 Q6.5 Q6.6 R245.2
NetQ6_3: Q6.3 Q7.3(C) R246.2
NetQ6_4: Q6.4 R246.1 U17.9(VDD_RF)
NetQ7_1: Q7.1(B) R248.1
NetR244_1: R244.1 U17.20(TXD1)
NetR247_1: R247.1 U17.3(1PPS)
NetR248_2: R248.2 U17.14(ANT_ON)

Not connected (* = marked no-connect by the designer): U17 2(RESERVED) 4(RESERVED) 5(RESERVED) 6(RESERVED) 15(RESERVED) 16(RESERVED) 17(RESERVED) 18(RESERVED) 19(RESERVED)

### Layout directives
net class SE_50: GNSS_RF, GNSS_RF_BIASED

### Notes on the sheet
- nRST should be driven open-drain
- Omit pi-match because we are only going to use cabled 50-ohm antennas.
- (near D39) RXD1 is internally 2.8 volt logic
- VCC should be supplied by LDO
- Diode-OR to allow bootup without coin cell
- Quectel LC29HEA dual-band GNSS module

### Library data of the parts
C98 C134 = 0402CG101J500NT: Manufacturer: FH(Guangdong Fenghua Advanced Tech); Dielectric: C0G; ComponentLink1URL: https://wmsc.lcsc.com/wmsc/upload/file/pdf/v2/lcsc/2304140030_FH--Guangdong-Fenghua-Advanced-Tech-0402CG101J500NT_C1546.pdf; ComponentLink1Description: Datasheet; Manufacturer Part Number: 0402CG101J500NT; Package: 0402; Supplier 2: LCSC; Supplier Part Number 2: C1546
C100 C164-C166 = CL05B104KB54PNC: as C91 on sheet eth_10base-t1s_phy; ComponentLink1URL: https://wmsc.lcsc.com/wmsc/upload/file/pdf/v2/lcsc/2304140030_Samsung-Electro-Mechanics-CL05B104KB54PNC_C307331.pdf; ComponentLink1Description: Datasheet; Manufacturer Part Number: CL05B104KB54PNC; Package: 0402; Supplier 2: LCSC; Supplier Part Number 2: C307331
D39-D41 = BAT54XV2T1G: ON Semi BAT54XV2T1G; SMT Schottky Diode; 30V 200mA; 5ns; 2-Pin SOD-523; Manufacturer: onsemi; Supplier 1: DigiKey; Supplier Part Number 1: BAT54XV2T1GOSCT-ND; Manufacturer Part Number: BAT54XV2T1G; Supplier 2: LCSC; Supplier Part Number 2: C81572; ComponentLink1Description: Datasheet; ComponentLink1URL: https://www.onsemi.com/pdf/datasheet/bat54xv2t1-d.pdf; Diode Type: Schottky; Supplier 3: Mouser; Supplier Part Number 3: 863-BAT54XV2T1G
D42 = TPD1E01B04DPYR: 3.6 V bidirectional ESD protection diode for high-speed data lines; Manufacturer: Texas Instruments; Supplier 1: DigiKey; Supplier Part Number 1: 296-48721-1-ND; Manufacturer Part Number: TPD1E01B04DPYR; ComponentLink1URL: https://www.ti.com/lit/ds/symlink/tpd1e01b04.pdf; ComponentLink1Description: Datasheet; Polarity: Bidirectional; Supplier 2: LCSC; Supplier Part Number 2: C779389; Supplier 3: Mouser; Supplier Part Number 3: 595-TPD1E01B04DPYR
J14 = RFPC-SMA14-FN-A: SMA Connector Jack, Female Socket Panel Mount, Through Hole, Right Angle Solder, IP68 unmated; Manufacturer: GCT (Gradconn); Supplier 1: DigiKey; Supplier Part Number 1: 2072-RFPC-SMA14-FN-A-ND; Manufacturer Part Number: RFPC-SMA14-FN-A; ComponentLink1Description: Datasheet; ComponentLink1URL: https://www.gradconn.com/Files/Drawings/RFPC-SMA14-FN.pdf; Supplier 2: LCSC; Supplier Part Number 2: C3173272; Supplier 3: Mouser; Supplier Part Number 3: 640-RFPCSMA14FNA
L4 = LQW18AN68NJ80D: 68 nH chip inductor, ±5%; Manufacturer: Murata; Current Rating (mA): 630; DCR (mOhms): 380; Supplier 1: DigiKey; Supplier Part Number 1: LQW18AN68NJ80D-ND; Manufacturer Part Number: LQW18AN68NJ80D; Supplier 2: LCSC; Supplier Part Number 2: C269832; Supplier 3: Mouser; Supplier Part Number 3: 81-LQW18AN68NJ80D; ComponentLink1Description: Datasheet; ComponentLink1URL: https://www.mouser.com/datasheet/2/281/1/JELF243A_0102-3158940.pdf
Q6 = FDC638P: MOSFET P-CH 20V 4.5A SSOT-6; Manufacturer: onsemi; Channel Type: P-channel; Supplier 1: DigiKey; ComponentLink1URL: https://www.onsemi.com/pdf/datasheet/fdc638p-d.pdf; ComponentLink1Description: Datasheet; Supplier Part Number 1: FDC638PCT-ND; Manufacturer Part Number: FDC638P; Supplier 2: LCSC; Supplier Part Number 2: C241772; Supplier 3: Mouser; Supplier Part Number 3: 512-FDC638P
Q7 = MMBT3904T: Bipolar (BJT) Transistor NPN 40 V 200 mA 300MHz 150 mW Surface Mount SOT-523; Manufacturer: Shenzhen Slkormicro Semicon Co., Ltd.; Supplier 1: DigiKey; Supplier Part Number 1: 5399-MMBT3904TCT-ND; Manufacturer Part Number: MMBT3904T; ComponentLink1Description: Datasheet; ComponentLink1URL: https://mm.digikey.com/Volume0/opasdata/d220001/medias/docus/7136/5399_MMBT3904T%20SOT-523.pdf; Supplier 2: LCSC; Supplier Part Number 2: C61616; Polarity: NPN
R244 R247 = 0402WGF330JTCE: as R149-R153 on sheet eth_10base-t1s_phy; ComponentLink1Description: Datasheet; ComponentLink1URL: https://wmsc.lcsc.com/wmsc/upload/file/pdf/v2/lcsc/2205311900_UNI-ROYAL-Uniroyal-Elec-0402WGF330JTCE_C25105.pdf; Manufacturer Part Number: 0402WGF330JTCE; Package: 0402; Supplier 2: LCSC; Supplier Part Number 2: C25105
R245 = RTT2510R0FTE: Manufacturer: RALEC; Tolerance: 1%; Temperature Coefficient: ±100ppm/?; Power Rating (mW): 1000; ComponentLink1Description: Datasheet; ComponentLink1URL: https://wmsc.lcsc.com/wmsc/upload/file/pdf/v2/lcsc/2304140030_RALEC-RTT2510R0FTE_C105071.pdf; Manufacturer Part Number: RTT2510R0FTE; Package: 2512; Supplier 2: LCSC; Supplier Part Number 2: C105071
R246 R248 R250 = 0402WGF1002TCE: as R146-R148 on sheet eth_10base-t1s_phy; ComponentLink1Description: Datasheet; ComponentLink1URL: https://wmsc.lcsc.com/wmsc/upload/file/pdf/v2/lcsc/2206010100_UNI-ROYAL-Uniroyal-Elec-0402WGF1002TCE_C25744.pdf; Manufacturer Part Number: 0402WGF1002TCE; Package: 0402; Supplier 2: LCSC; Supplier Part Number 2: C25744
U17 = LC29HEAMD: Rf Txrx Module Navigation SMD; Manufacturer: Quectel; Manufacturer Part Number: LC29HEAMD; Supplier 1: DigiKey; Supplier Part Number 1: 2958-LC29HEAMDCT-ND; Supplier 2: LCSC; Supplier Part Number 2: C28453488; Supplier 3: Mouser; Supplier Part Number 3: 277--LC29HEAMD; ComponentLink1Description: Datasheet; ComponentLink1URL: https://www.quectel.com/content/uploads/2026/03/Quectel_LC29H_Series_GNSS_Module_Specification_V2.0.pdf

## Sheet analog_lvb_sense.SchDoc
size A
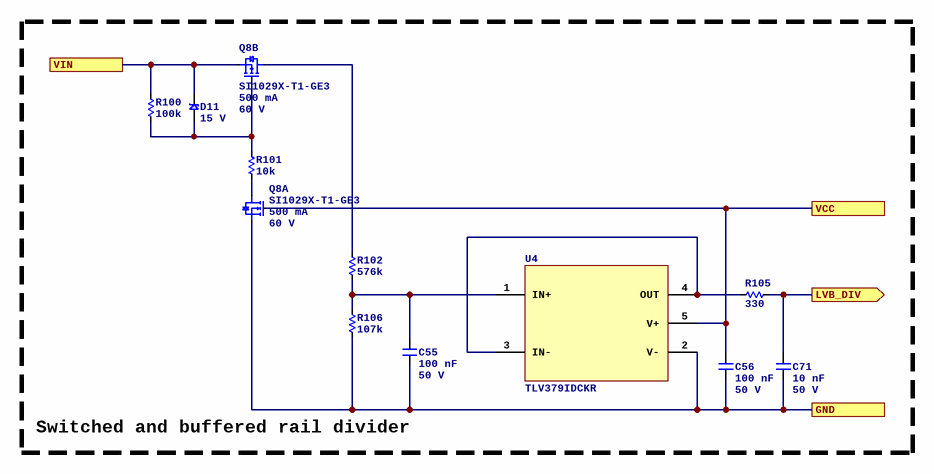
[diagram p45: analog_lvb_sense.SchDoc]

### Parts
C55  Capacitance: 100 nF  Voltage Rating: 50 V  [C0402]  (hidden comment: CL05B104KB54PNC)
C56  Capacitance: 100 nF  Voltage Rating: 50 V  [C0402]  (hidden comment: CL05B104KB54PNC)
C71  Capacitance: 10 nF  Voltage Rating: 50 V  [C0402]  (hidden comment: CL05B103KB5NNNC)
D11  Vr: 15 V  [SOD323]  (hidden comment: MM3Z15VC)
Q8  SI1029X-T1-GE3  Current: 500 mA  Voltage: 60 V  [6SOT563]  (parts A,B of 2)
R100  value 100k  [R0402]  (hidden comment: 0402WGF1003TCE)
R101  value 10k  [R0402]  (hidden comment: 0402WGF1002TCE)
R102  value 576k  [R0402]  (hidden comment: 0402WGF5763TCE)
R105  value 330  [R0402]  (hidden comment: 0402WGF3300TCE)
R106  value 107k  [R0402]  (hidden comment: 0402WGF1073TCE)
U4  TLV379IDCKR  [5SC70]

### Blocks framed on the sheet
Switched and buffered rail divider: C55 C56 C71 D11 Q8 R100-R102 R105 R106 U4

### Ports
GND, LVB_DIV (out), VCC, VIN

### Nets
5P0: C56.1 Q8.2 U4.5(V+) ; port VCC
GND: C55.2 C56.2 C71.2 Q8.1 R106.1 U4.2(V-) ; port GND
LVB: D11.2 Q8.4 R100.1 ; port VIN
LVB_DIV: C71.1 R105.2 ; port LVB_DIV
NetC55_1: C55.1 R102.1 R106.2 U4.1(IN+)
NetD11_1: D11.1 Q8.5 R100.2 R101.1
NetQ8_3: Q8.3 R102.2
NetQ8_6: Q8.6 R101.2
NetR105_1: R105.1 U4.3(IN-) U4.4(OUT)

### Library data of the parts
C55 C56 = CL05B104KB54PNC: as C91 on sheet eth_10base-t1s_phy; ComponentLink1URL: https://wmsc.lcsc.com/wmsc/upload/file/pdf/v2/lcsc/2304140030_Samsung-Electro-Mechanics-CL05B104KB54PNC_C307331.pdf; ComponentLink1Description: Datasheet; Manufacturer Part Number: CL05B104KB54PNC; Package: 0402; Supplier 2: LCSC; Supplier Part Number 2: C307331
C71 = CL05B103KB5NNNC: as C199 on sheet pmic_tps79933; ComponentLink1URL: https://wmsc.lcsc.com/wmsc/upload/file/pdf/v2/lcsc/2304140030_Samsung-Electro-Mechanics-CL05B103KB5NNNC_C15195.pdf; ComponentLink1Description: Datasheet; Manufacturer Part Number: CL05B103KB5NNNC; Package: 0402; Supplier 2: LCSC; Supplier Part Number 2: C15195
D11 = MM3Z15VC: DIODE ZENER 15V 200MW SOD; Manufacturer: onsemi; Current: 13.3 mA; Supplier 1: DigiKey; Manufacturer Part Number: MM3Z15VC; ComponentLink1URL: https://www.onsemi.com/pdf/datasheet/mm3z9v1c-d.pdf; ComponentLink1Description: Datasheet; Supplier Part Number 1: MM3Z15VCCT-ND; Supplier 2: LCSC; Supplier Part Number 2: C891582; Diode Type: Zener; Supplier 3: Mouser; Supplier Part Number 3: 512-MM3Z15VC
Q8 = SI1029X-T1-GE3: Small Signal Field-Effect Transistor, 0.305A I(D), 60V, 2-Element, N-Channel and P-Channel, Silicon, Metal-oxide Semiconductor FET; Manufacturer: Vishay Siliconix; Supplier 1: DigiKey; Supplier Part Number 1: SI1029X-T1-GE3CT-ND; Manufacturer Part Number: SI1029X-T1-GE3; ComponentLink1Description: Datasheet; ComponentLink1URL: https://www.vishay.com/docs/71435/si1029x.pdf; Supplier 2: LCSC; Supplier Part Number 2: C144890; Channel Type: N-channel and P-channel; Supplier 3: Mouser; Supplier Part Number 3: 781-SI1029X-T1-GE3
R100 = 0402WGF1003TCE: Manufacturer: UNI-ROYAL(Uniroyal Elec); Tolerance: 1%; Temperature Coefficient: ±100ppm/?; Power Rating (mW): 62.5; ComponentLink1Description: Datasheet; ComponentLink1URL: https://wmsc.lcsc.com/wmsc/upload/file/pdf/v2/lcsc/2206010100_UNI-ROYAL-Uniroyal-Elec-0402WGF1003TCE_C25741.pdf; Manufacturer Part Number: 0402WGF1003TCE; Package: 0402; Supplier 2: LCSC; Supplier Part Number 2: C25741
R101 = 0402WGF1002TCE: as R146-R148 on sheet eth_10base-t1s_phy; ComponentLink1Description: Datasheet; ComponentLink1URL: https://wmsc.lcsc.com/wmsc/upload/file/pdf/v2/lcsc/2206010100_UNI-ROYAL-Uniroyal-Elec-0402WGF1002TCE_C25744.pdf; Manufacturer Part Number: 0402WGF1002TCE; Package: 0402; Supplier 2: LCSC; Supplier Part Number 2: C25744
R102 = 0402WGF5763TCE: Manufacturer: UNI-ROYAL(Uniroyal Elec); Tolerance: 1%; Temperature Coefficient: ±100ppm/?; Power Rating (mW): 62.5; Manufacturer Part Number: 0402WGF5763TCE; ComponentLink1Description: Datasheet; ComponentLink1URL: https://wmsc.lcsc.com/wmsc/upload/file/pdf/v2/lcsc/2206010030_UNI-ROYAL-Uniroyal-Elec-0402WGF5763TCE_C27012.pdf; Package: 0402; Supplier 2: LCSC; Supplier Part Number 2: C27012
R105 = 0402WGF3300TCE: Manufacturer: UNI-ROYAL(Uniroyal Elec); Tolerance: 1%; Temperature Coefficient: ±100ppm/?; Power Rating (mW): 62.5; ComponentLink1Description: Datasheet; ComponentLink1URL: https://wmsc.lcsc.com/wmsc/upload/file/pdf/v2/lcsc/2205311900_UNI-ROYAL-Uniroyal-Elec-0402WGF3300TCE_C25104.pdf; Manufacturer Part Number: 0402WGF3300TCE; Package: 0402; Supplier 2: LCSC; Supplier Part Number 2: C25104
R106 = 0402WGF1073TCE: Manufacturer: UNI-ROYAL(Uniroyal Elec); Tolerance: 1%; Temperature Coefficient: ±100ppm/?; Power Rating (mW): 62.5; Manufacturer Part Number: 0402WGF1073TCE; ComponentLink1Description: Datasheet; ComponentLink1URL: https://wmsc.lcsc.com/wmsc/upload/file/pdf/v2/lcsc/2206010100_UNI-ROYAL-Uniroyal-Elec-0402WGF1073TCE_C25743.pdf; Package: 0402; Supplier 2: LCSC; Supplier Part Number 2: C25743
U4 = TLV379IDCKR: Low-Voltage, 4-µA, Rail-to-Rail I/O Operational Amplifier for Cost-Sensitive Systems 5-SC70 -40 to 125; Manufacturer: Texas Instruments; Supplier 1: DigiKey; Supplier Part Number 1: 296-47844-1-ND; Manufacturer Part Number: TLV379IDCKR; Supplier Part Number 2: C2860386; ComponentLink1Description: Datasheet; ComponentLink1URL: https://www.ti.com/lit/ds/symlink/tlv379.pdf; Supplier 2: LCSC; Supplier 3: Mouser; Supplier Part Number 3: 595-TLV379IDCKR